# Altium schematic sheet HVPS.SchDoc
size 584 x 381 mm; SheetNumber: 1; SheetTotal: 1
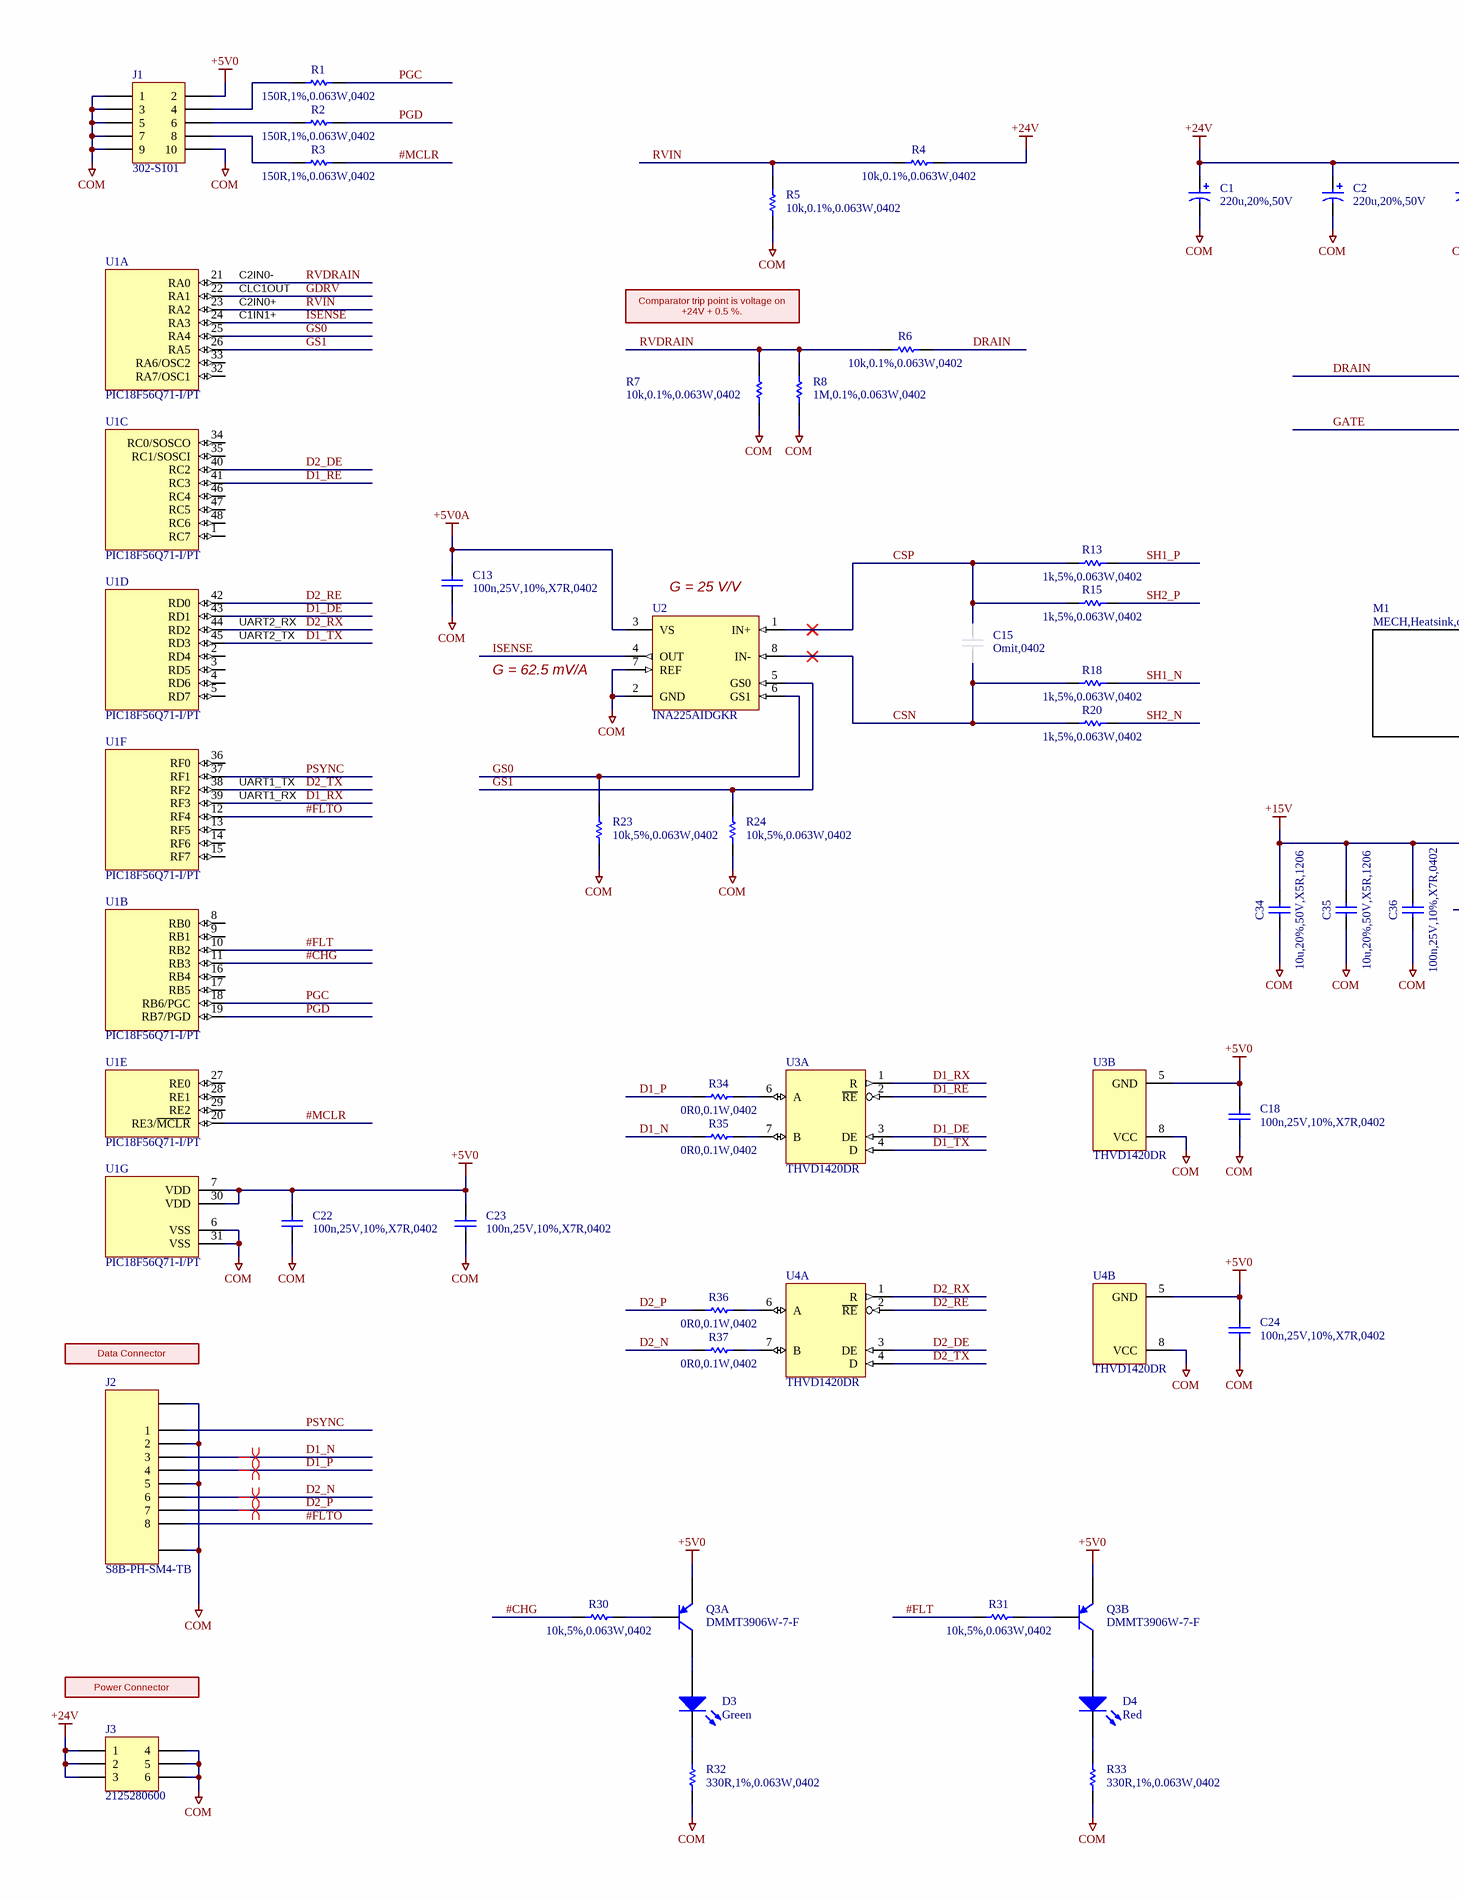
[diagram p0: HVPS.SchDoc, left]
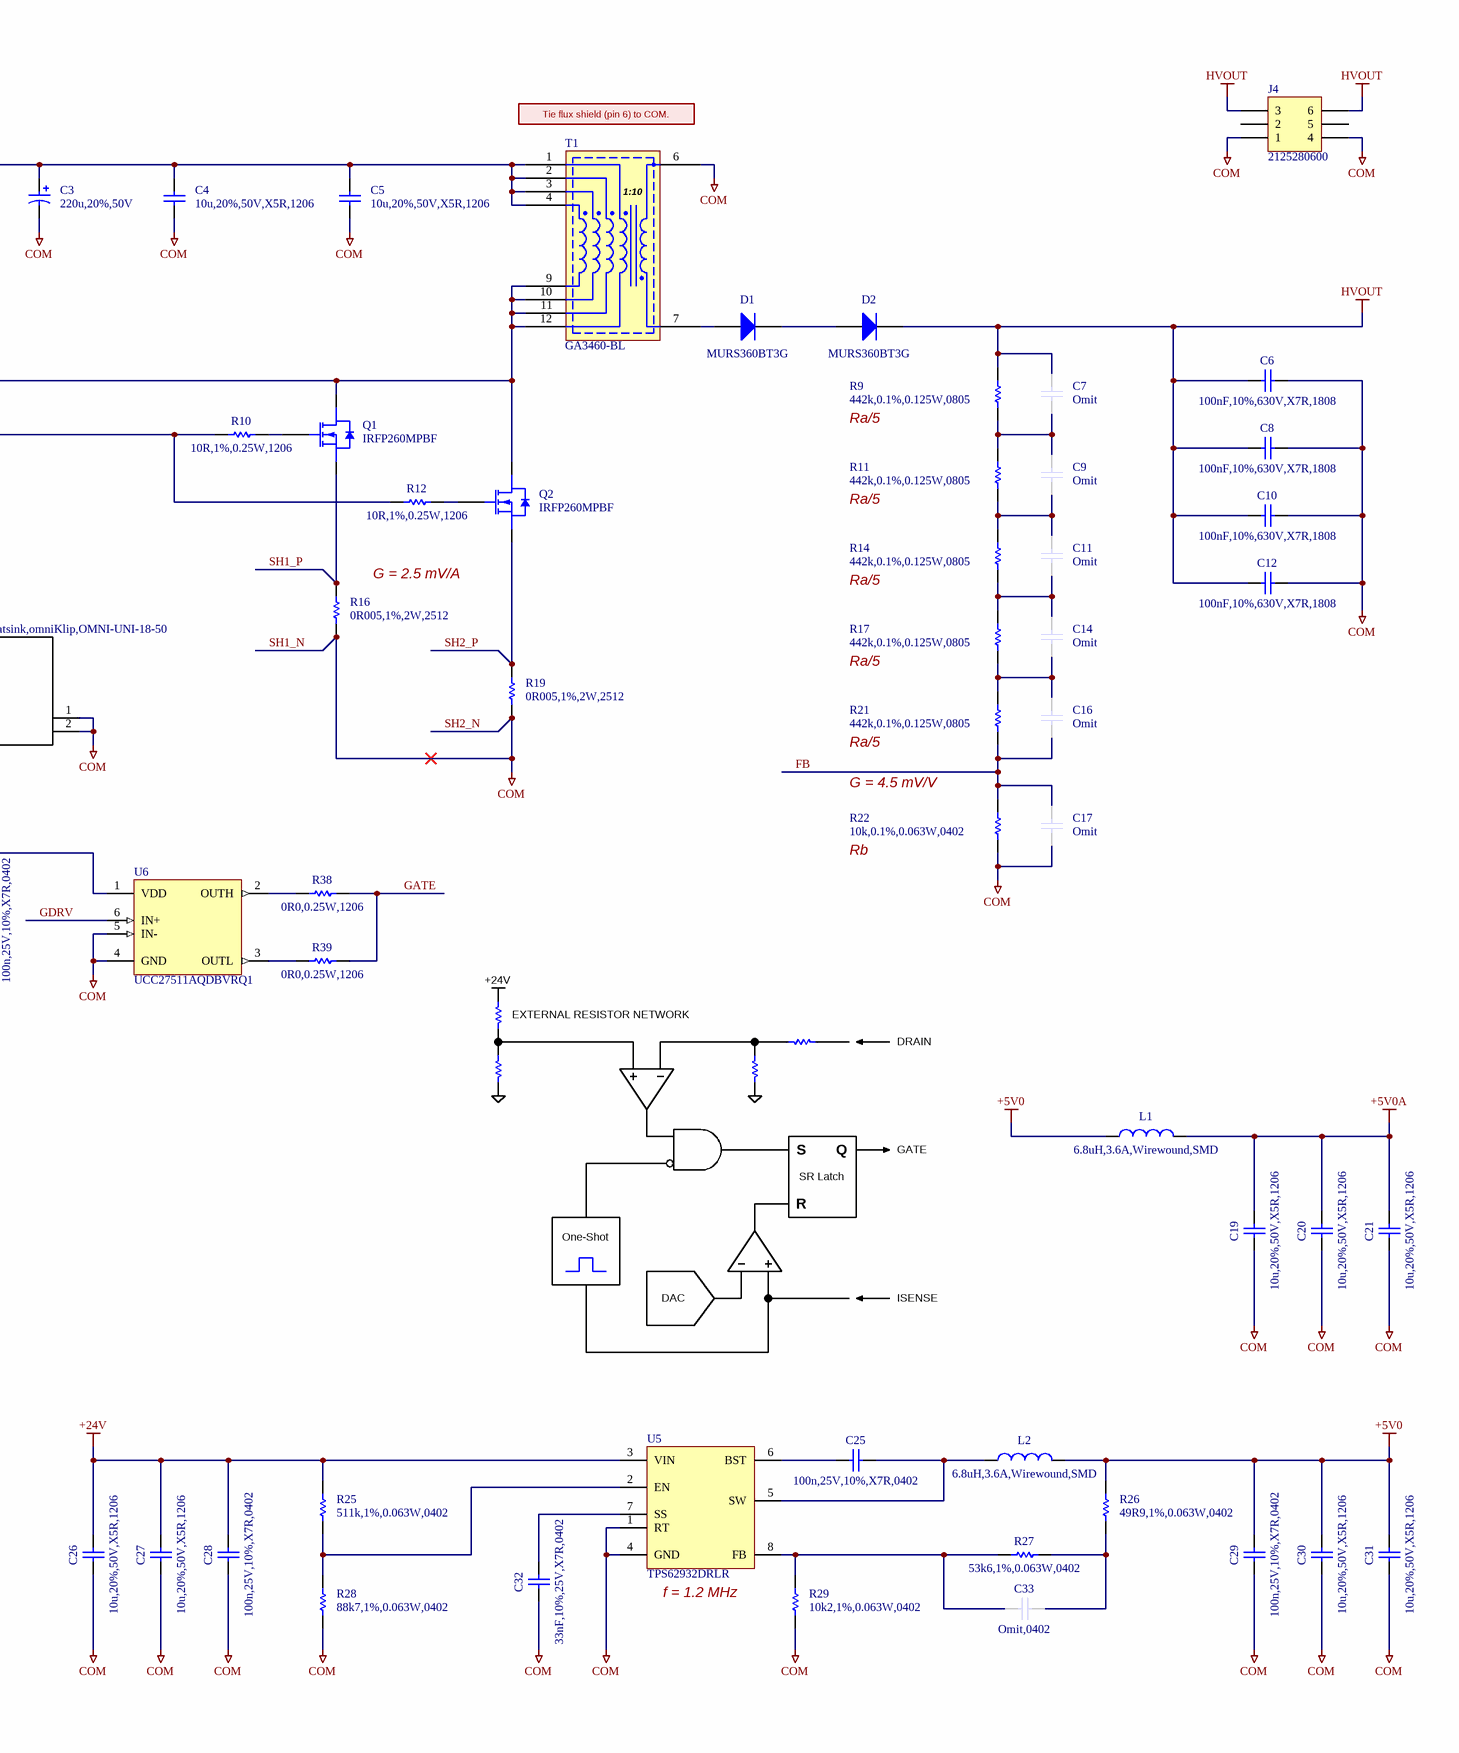
[diagram p1: HVPS.SchDoc, right]

## Parts
C1  220u,20%,50V  [CAPPR500W60D1000H1600B]
C2  220u,20%,50V  [CAPPR500W60D1000H1600B]
C3  220u,20%,50V  [CAPPR500W60D1000H1600B]
C4  10u,20%,50V,X5R,1206  [CAPC3216X16N]
C5  10u,20%,50V,X5R,1206  [CAPC3216X16N]
C6  100nF,10%,630V,X7R,1808  [KEMET_PKG_LC]
C7  Omit  [CAPC_0805]  (no BOM)
C8  100nF,10%,630V,X7R,1808  [KEMET_PKG_LC]
C9  Omit  [CAPC_0805]  (no BOM)
C10  100nF,10%,630V,X7R,1808  [KEMET_PKG_LC]
C11  Omit  [CAPC_0805]  (no BOM)
C12  100nF,10%,630V,X7R,1808  [KEMET_PKG_LC]
C13  100n,25V,10%,X7R,0402  [CAPC1005X06N]
C14  Omit  [CAPC_0805]  (no BOM)
C15  Omit,0402  [CAPC1005X06N]  (no BOM)
C16  Omit  [CAPC_0805]  (no BOM)
C17  Omit  [CAPC_0805]  (no BOM)
C18  100n,25V,10%,X7R,0402  [CAPC1005X06N]
C19  10u,20%,50V,X5R,1206  [CAPC3216X16N]
C20  10u,20%,50V,X5R,1206  [CAPC3216X16N]
C21  10u,20%,50V,X5R,1206  [CAPC3216X16N]
C22  100n,25V,10%,X7R,0402  [CAPC1005X06N]
C23  100n,25V,10%,X7R,0402  [CAPC1005X06N]
C24  100n,25V,10%,X7R,0402  [CAPC1005X06N]
C25  100n,25V,10%,X7R,0402  [CAPC1005X06N]
C26  10u,20%,50V,X5R,1206  [CAPC3216X16N]
C27  10u,20%,50V,X5R,1206  [CAPC3216X16N]
C28  100n,25V,10%,X7R,0402  [CAPC1005X06N]
C29  100n,25V,10%,X7R,0402  [CAPC1005X06N]
C30  10u,20%,50V,X5R,1206  [CAPC3216X16N]
C31  10u,20%,50V,X5R,1206  [CAPC3216X16N]
C32  33nF,10%,25V,X7R,0402  [CAPC1005X06N]
C33  Omit,0402  [CAPC1005X06N]  (no BOM)
C34  10u,20%,50V,X5R,1206  [CAPC3216X16N]
C35  10u,20%,50V,X5R,1206  [CAPC3216X16N]
C36  100n,25V,10%,X7R,0402  [CAPC1005X06N]
D1  MURS360BT3G  [ONSEMI_SMB]
D2  MURS360BT3G  [ONSEMI_SMB]
D3  Green  [LITE-ON_LTST-C190KGKT]
D4  Red  [LITE-ON_LTST-C190KRKT]
J1  302-S101  [ONSHORE_302-S101]
J2  S8B-PH-SM4-TB  [JST_S8B-PH-SM4-TB]
J3  2125280600  [MOLEX_2125280600]
J4  2125280600  [MOLEX_2125280600]
L1  6.8uH,3.6A,Wirewound,SMD  [BOURNS_SRN6045TA]
L2  6.8uH,3.6A,Wirewound,SMD  [BOURNS_SRN6045TA]
M1  MECH,Heatsink,omniKlip,OMNI-UNI-18-50  [WAKEFIELD_OMNI-UNI-18-50]
Q1  IRFP260MPBF  [INFINEON_PKG_TO247AD]
Q2  IRFP260MPBF  [INFINEON_PKG_TO247AD]
Q3  DMMT3906W-7-F  [DIODES_SOT363]  (parts A,B of 2)
R1  150R,1%,0.063W,0402  [RESC1005X04N]
R2  150R,1%,0.063W,0402  [RESC1005X04N]
R3  150R,1%,0.063W,0402  [RESC1005X04N]
R4  10k,0.1%,0.063W,0402  [RESC1005X04N]
R5  10k,0.1%,0.063W,0402  [RESC1005X04N]
R6  10k,0.1%,0.063W,0402  [RESC1005X04N]
R7  10k,0.1%,0.063W,0402  [RESC1005X04N]
R8  1M,0.1%,0.063W,0402  [RESC1005X04N]
R9  442k,0.1%,0.125W,0805  [RESC2012X07N]
R10  10R,1%,0.25W,1206  [RESC3216X06N]
R11  442k,0.1%,0.125W,0805  [RESC2012X07N]
R12  10R,1%,0.25W,1206  [RESC3216X06N]
R13  1k,5%,0.063W,0402  [RESC1005X04N]
R14  442k,0.1%,0.125W,0805  [RESC2012X07N]
R15  1k,5%,0.063W,0402  [RESC1005X04N]
R16  0R005,1%,2W,2512  [OHMITE_PKG_MCS3264]
R17  442k,0.1%,0.125W,0805  [RESC2012X07N]
R18  1k,5%,0.063W,0402  [RESC1005X04N]
R19  0R005,1%,2W,2512  [OHMITE_PKG_MCS3264]
R20  1k,5%,0.063W,0402  [RESC1005X04N]
R21  442k,0.1%,0.125W,0805  [RESC2012X07N]
R22  10k,0.1%,0.063W,0402  [RESC1005X04N]
R23  10k,5%,0.063W,0402  [RESC1005X04N]
R24  10k,5%,0.063W,0402  [RESC1005X04N]
R25  511k,1%,0.063W,0402  [RESC1005X04N]
R26  49R9,1%,0.063W,0402  [RESC1005X04N]
R27  53k6,1%,0.063W,0402  [RESC1005X04N]
R28  88k7,1%,0.063W,0402  [RESC1005X04N]
R29  10k2,1%,0.063W,0402  [RESC1005X04N]
R30  10k,5%,0.063W,0402  [RESC1005X04N]
R31  10k,5%,0.063W,0402  [RESC1005X04N]
R32  330R,1%,0.063W,0402  [RESC1005X04N]
R33  330R,1%,0.063W,0402  [RESC1005X04N]
R34  0R0,0.1W,0402  [RESC1005X04N]
R35  0R0,0.1W,0402  [RESC1005X04N]
R36  0R0,0.1W,0402  [RESC1005X04N]
R37  0R0,0.1W,0402  [RESC1005X04N]
R38  0R0,0.25W,1206  [RESC3216X06N]
R39  0R0,0.25W,1206  [RESC3216X06N]
T1  GA3460-BL  [COILCRAFT_GA3460-BL]
U1  PIC18F56Q71-I/PT  [TSQFP50P900X900X120-48N]  (parts A,B,C,D,E,F,G of 7)
U2  INA225AIDGKR  [SOP65P490X110-8]
U3  THVD1420DR  [TEXASINSTRUMENTS_PKG_D0008A]  (parts A,B of 2)
U4  THVD1420DR  [TEXASINSTRUMENTS_PKG_D0008A]  (parts A,B of 2)
U5  TPS62932DRLR  [TEXASINSTRUMENTS_PKG_DRL0008A]
U6  UCC27511AQDBVRQ1  [SOTFL95P260X145-6]

## Nets
+5V0: C18.2 C22.2 C23.2 C24.2 C29.2 C30.2 C31.2 J1.2 L1.1 L2.2 Q3.4(E1) Q3.5(E2) R26.2 U1.7(VDD) U1.30(VDD) U3.5(GND) U4.5(GND)
+5V0A: C13.2 C19.2 C20.2 C21.2 L1.2 U2.3(VS)
+15V: C34.2 C35.2 C36.2 U6.1(VDD)
+24V: C1.1 C2.1 C3.1 C4.2 C5.2 C26.2 C27.2 C28.2 J3.1 J3.2 J3.3 R4.1 R25.2 T1.1 T1.2 T1.3 T1.4 U5.3(VIN)
HVOUT: C6.2 C7.2 C8.2 C10.2 C12.2 D2.1(K) J4.3 J4.6 R9.2
SH1_N: C1.2 C2.2 C3.2 C4.1 C5.1 C6.1 C8.1 C10.1 C12.1 C13.1 C17.1 C18.1 C19.1 C20.1 C21.1 C22.1 C23.1 C24.1 C26.1 C27.1 C28.1 C29.1 C30.1 C31.1 C32.1 C34.1 C35.1 C36.1 J1.1 J1.3 J1.5 J1.7 J1.9 J1.10 J2.0 J2.2 J2.5 J3.4 J3.5 J3.6 J4.1 J4.4 M1.1 M1.2 R5.2 R7.2 R8.1 R16.1 R18.2 R19.1 R20.2 R22.1 R23.1 R24.1 R28.1 R29.1 R32.1 R33.1 T1.6 U1.6(VSS) U1.31(VSS) U2.2(GND) U2.7(REF) U3.8(VCC) U4.8(VCC) U5.1(RT) U5.4(GND) U6.4(GND) U6.5(IN-)  [also labelled COM, SH2_N]
#CHG: R30.2 U1.11(RB3)
#FLT: R31.2 U1.10(RB2)
#FLTO: J2.8 U1.12(RF4)
#MCLR: R3.2 U1.20(RE3/~{MCLR})
CSN: C15.1 R18.1 R20.1 U2.8(IN-)
CSP: C15.2 R13.1 R15.1 U2.1(IN+)
D1_DE: U1.43(RD1) U3.3(DE)
D1_N: J2.3 R35.1
D1_P: J2.4 R34.1
D1_RE: U1.41(RC3) U3.2(~{RE})
D1_RX: U1.39(RF3) U3.1(R)
D1_TX: U1.45(RD3) U3.4(D)
D2_DE: U1.40(RC2) U4.3(DE)
D2_N: J2.6 R37.1
D2_P: J2.7 R36.1
D2_RE: U1.42(RD0) U4.2(~{RE})
D2_RX: U1.44(RD2) U4.1(R)
D2_TX: U1.38(RF2) U4.4(D)
DRAIN: Q1.2(D) Q2.2(D) R6.1 T1.9 T1.10 T1.11 T1.12
FB: C16.1 C17.2 R21.1 R22.2
GATE: R10.1 R12.1 R38.2 R39.2
GDRV: U1.22(RA1) U6.6(IN+)
GS0: R23.2 U1.25(RA4) U2.6(GS1)
GS1: R24.2 U1.26(RA5) U2.5(GS0)
ISENSE: U1.24(RA3) U2.4(OUT)
PGC: R1.2 U1.18(RB6/PGC)
PGD: R2.2 U1.19(RB7/PGD)
PSYNC: J2.1 U1.37(RF1)
RVDRAIN: R6.2 R7.1 R8.2 U1.21(RA0)
RVIN: R4.2 R5.1 U1.23(RA2)
SH1_P: Q1.3(S) R13.2 R16.2
SH2_P: Q2.3(S) R15.2 R19.2
NetC7_1: C7.1 C9.2 R9.1 R11.2
NetC9_1: C9.1 C11.2 R11.1 R14.2
NetC11_1: C11.1 C14.2 R14.1 R17.2
NetC14_1: C14.1 C16.2 R17.1 R21.2
NetC25_1: C25.1 L2.1 U5.5(SW)
NetC25_2: C25.2 U5.6(BST)
NetC32_2: C32.2 U5.7(SS)
NetC33_1: C33.1 R27.2 R29.2 U5.8(FB)
NetC33_2: C33.2 R26.1 R27.1
NetD1_1: D1.1(K) D2.2(A)
NetD1_2: D1.2(A) T1.7
NetD3_A: D3.A Q3.3(C1)
NetD3_C: D3.C R32.2
NetD4_A: D4.A Q3.6(C2)
NetD4_C: D4.C R33.2
NetJ1_4: J1.4 R1.1
NetJ1_6: J1.6 R2.1
NetJ1_8: J1.8 R3.1
NetQ1_1: Q1.1(G) R10.2
NetQ2_1: Q2.1(G) R12.2
NetQ3_1: Q3.1(B2) R31.1
NetQ3_2: Q3.2(B1) R30.1
NetR25_1: R25.1 R28.2 U5.2(EN)
NetR34_2: R34.2 U3.6(A)
NetR35_2: R35.2 U3.7(B)
NetR36_2: R36.2 U4.6(A)
NetR37_2: R37.2 U4.7(B)
NetR38_1: R38.1 U6.2(OUTH)
NetR39_1: R39.1 U6.3(OUTL)

Not connected (* = marked no-connect by the designer): J4 2 5; U1 1(RC7) 2(RD4) 3(RD5) 4(RD6) 5(RD7) 8(RB0) 9(RB1) 13(RF5) 14(RF6) 15(RF7) 16(RB4) 17(RB5) 27(RE0) 28(RE1) 29(RE2) 32(RA7/OSC1) 33(RA6/OSC2) 34(RC0/SOSCO) 35(RC1/SOSCI) 36(RF0) 46(RC4) 47(RC5) 48(RC6)

## Layout directives
differential pair: D1_N, D1_P, D2_N, D2_P

## Notes on the sheet
- (near T1) Tie flux shield (pin 6) to COM.
- (near U1) C2IN0-
- (near U1) C2IN0+
- (near U1) CLC1OUT
- (near U1) C1IN1+
- Comparator trip point is voltage on +24V + 0.5 %.
- Ra/5
- G = 2.5 mV/A
- (near U1) UART2_TX
- (near U1) UART2_RX
- (near U2) G = 25 V/V
- G = 62.5 mV/A
- G = 4.5 mV/V
- (near U1) UART1_TX
- (near U1) UART1_RX
- Rb
- +24V
- EXTERNAL RESISTOR NETWORK
- DRAIN
- S
- SR Latch
- Q
- GATE
- One-Shot
- R
- DAC
- ISENSE
- (near J2) Data Connector
- (near U5) f = 1.2 MHz
- Power Connector
- (in symbol XFR,Flyback,COILCRAFT_GA3460-BL) 1:10

## Library data of the parts
C1-C3 = CAP,Alum,220uF,20%,50VDC,Radial,Thru: 220 ï¿½F 50 V Aluminum Electrolytic Capacitors Radial, Can 5000 Hrs @ 105ï¿½C; Manufacturer 1: Rubycon; Manufacturer 1 Part Number: 50YXG220MEFCT810X16; Vendor 1 Part Number: 1189-3771-1-ND; Vendor 1: Digikey; Part Name: CAP,Alum,220uF,20%,50VDC,Radial,Thru; CreatedBy: Judd Foster; HelpURL: https://www.rubycon.co.jp/wp-content/uploads/catalog-aluminum/YXG.pdf; Value: 220u
C4 C5 C19-C21 C26 C27 C30 C31 C34 C35 = CAP,Cer,10uF,50VDC,X5R,1206: 10ï¿½F ï¿½20% 50V Ceramic Capacitor X5R 1206 (3216 Metric); Manufacturer 1: Samsung Electro-Mechanics; Manufacturer 1 Part Number: CL31A106MBHNNNE; Vendor 1 Part Number: 1276-6736-1-ND; Vendor 1: Digikey; Part Name: CAP,Cer,10uF,50VDC,X5R,1206; CreatedBy: Judd Foster; HelpURL: https://www.samsungsem.com/resources/file/global/support/product_catalog/MLCC.pdf; Value: 10u
C6 C8 C10 C12 = CAP,Cer,100nF,10%,630V,X7R,1808: 0.1 ÂµF Â±10% 630V Ceramic Capacitor X7R 1808 (4520 Metric); Manufacturer 1: KEMET; Manufacturer 1 Part Number: C1808C104KBRAC7800; Vendor 1 Part Number: 399-C1808C104KBRAC7800CT-ND; Vendor 1: DigiKey; Part Name: CAP,Cer,100nF,10%,630V,X7R,1808; CreatedBy: Judd Foster; HelpURL: https://content.kemet.com/datasheets/KEM_C1010_X7R_HV_SMD.pdf; Value: 100nF
C7 C9 C11 C14 C16 C17 = CAP,Omit,0805: Part Name: CAP,Omit,0805; CreatedBy: Judd Foster; HelpURL: N/A; Manufacturer 1: N/A; Manufacturer 1 Part Number: N/A; Vendor 1: N/A; Vendor 1 Part Number: N/A; Value: Omit
C13 C18 C22-C25 C28 C29 C36 = CAP,Cer,100nF,10%,25VDC,X7R,0402: 0.1ï¿½F ï¿½10% 25V Ceramic Capacitor X7R 0402 (1005 Metric); Manufacturer 1: Murata Electronics; Manufacturer 1 Part Number: GRM155R71E104KE14J; Vendor 1 Part Number: 490-14603-1-ND; Vendor 1: DigiKey; Value: 100nF; Part Name: CAP,Cer,100nF,10%,25VDC,X7R,0402; CreatedBy: Judd Foster; HelpURL: https://search.murata.co.jp/Ceramy/image/img/A01X/G101/ENG/GRM155R71E104KE14-01.pdf
C15 C33 = CAP,Omit,0402: Omit; Part Name: CAP,Omit,0402; CreatedBy: Judd Foster; HelpURL: N/A; Manufacturer 1: N/A; Manufacturer 1 Part Number: N/A; Vendor 1: N/A; Vendor 1 Part Number: N/A; Value: Omit
C32 = CAP,Cer,33nF,10%,25V,X7R,0402: 0.033 ÂµF Â±10% 25V Ceramic Capacitor X7R 0402 (1005 Metric); Manufacturer 1: Murata Electronics; Manufacturer 1 Part Number: GRM155R71E333KA88D; Vendor 1 Part Number: 490-3253-1-ND; Vendor 1: DigiKey; Part Name: CAP,Cer,33nF,10%,25V,X7R,0402; CreatedBy: Judd Foster; HelpURL: https://search.murata.co.jp/Ceramy/image/img/A01X/G101/ENG/GRM155R71E333KA88-01.pdf; Value: 33nF
D1 D2 = Diode,Gen,600V,3A,SMB: Diode 600 V 3A Surface Mount SMB; Manufacturer 1: onsemi; Vendor 1 Part Number: MURS360BT3GOSCT-ND; Vendor 1: Digikey; Part Name: Diode,Gen,600V,3A,SMB; CreatedBy: Judd Foster; HelpURL: https://www.onsemi.com/pdf/datasheet/murs360bt3-d.pdf; Manufacturer 1 Part Number: MURS360BT3G
D3 = LED,Green,SMD,0603: Green 571nm LED Indication - Discrete 2V 0603 (1608 Metric); Manufacturer 1: Lite-On Inc.; Manufacturer 1 Part Number: LTST-C190KGKT; Vendor 1 Part Number: 160-1435-1-ND; Vendor 1: Digikey; Part Name: LED,Green,SMD,0603; CreatedBy: Judd Foster; HelpURL: https://optoelectronics.liteon.com/upload/download/DS22-2000-074/LTST-C190KGKT.PDF; Value: Green
D4 = LED,Red,SMD,0603: Red 631nm LED Indication - Discrete 2V 0603 (1608 Metric); Manufacturer 1: Lite-On Inc.; Manufacturer 1 Part Number: LTST-C190KRKT; Vendor 1 Part Number: 160-1436-1-ND; Vendor 1: Digikey; Part Name: LED,Red,SMD,0603; CreatedBy: Judd Foster; HelpURL: https://optoelectronics.liteon.com/upload/download/DS-22-99-0151/LTST-C190KRKT.pdf; Value: Red
J1 = Term,Header,5x2 Pin,2.54mm,Thru: Connector Header Through Hole 10 position 0.100" (2.54mm); Manufacturer 1: On Shore Technology Inc.; Vendor 1 Part Number: ED1543-ND; Vendor 1: Digikey; Part Name: Term,Header,5x2 Pin,2.54mm,Thru; CreatedBy: Judd Foster; HelpURL: https://mm.digikey.com/Volume0/opasdata/d220001/medias/docus/6025/302-S.pdf; Manufacturer 1 Part Number: 302-S101
J2 = CONN,JST,8 Pin,2mm,RA,SMD: Connector Header Surface Mount, Right Angle 8 position 0.079" (2.00mm); Manufacturer 1: JST Sales America Inc.; Vendor 1 Part Number: 455-S8B-PH-SM4-TBCT-ND; Vendor 1: DigiKey; Part Name: CONN,JST,8 Pin,2mm,RA,SMD; CreatedBy: Judd Foster; HelpURL: https://www.jst-mfg.com/product/pdf/eng/ePH.pdf; Manufacturer 1 Part Number: S8B-PH-SM4-TB
J3 J4 = Conn,Micro-Fit,Hdr,6Pos,RA,Thru: Connector Header Through Hole, Right Angle 6 position 0.118" (3.00mm); Manufacturer 1: Molex; Vendor 1 Part Number: 900-2125280600-ND; Vendor 1: Digikey; Part Name: Conn,Micro-Fit,Hdr,6Pos,RA,Thru; CreatedBy: Judd Foster; HelpURL: https://www.molex.com/webdocs/datasheets/pdf/en-us/2125280600_PCB_HEADERS.pdf; Manufacturer 1 Part Number: 2125280600
L1 L2 = IND,6.8uH,3.6A,Wirewound,SMD: 6.8 ÂµH Semi-Shielded Drum Core, Wirewound Inductor 3.6 A 34mOhm Nonstandard; Manufacturer 1: Bourns Inc.; Manufacturer 1 Part Number: SRN6045TA-6R8M; Vendor 1 Part Number: SRN6045TA-6R8MCT-ND; Vendor 1: DigiKey; Part Name: IND,6.8uH,3.6A,Wirewound,SMD; CreatedBy: Judd Foster; HelpURL: https://www.bourns.com/docs/Product-Datasheets/SRN6045TA.pdf; Value: 6.8uH
M1 = MECH,Heatsink,omniKlip,OMNI-UNI-18-50: Heat Sinks omniKlip Heat Sink for TO-247, TO-264, 18mm Wide, 50mm Long, Aluminum; Manufacturer 1: Wakefield Thermal; Vendor 1 Part Number: 567-OMNI-UNI-18-50; Vendor 1: Mouser; Part Name: MECH,Heatsink,omniKlip,OMNI-UNI-18-50; CreatedBy: Judd Foster; HelpURL: https://www.mouser.com/datasheet/2/433/omniKlip_Wakefield_Vette-3050203.pdf; Manufacturer 1 Part Number: OMNI-UNI-18-50
Q1 Q2 = MOSFET,N Ch,200V,50A,IRFP260MPBF: N-Channel 200 V 50A (Tc) 300W (Tc) Through Hole TO-247AC; Manufacturer 1: Infineon Technologies; Vendor 1 Part Number: IRFP260MPBF-ND; Vendor 1: DigiKey; Part Name: MOSFET,N Ch,200V,50A,IRFP260MPBF; CreatedBy: Judd Foster; HelpURL: https://www.infineon.com/dgdl/irfp260mpbf.pdf?fileId=5546d462533600a40153562894e91fe0; Manufacturer 1 Part Number: IRFP260MPBF
Q3 = Trans,PNP,Dual,40V,200mA,SOT363: Bipolar (BJT) Transistor Array 2 PNP (Dual) Matched Pair 40V 200mA 250MHz 200mW Surface Mount SOT-363; Manufacturer 1: Diodes Incorporated; Vendor 1 Part Number: DMMT3906W-FDICT-ND; Vendor 1: Digikey; Part Name: Trans,PNP,Dual,40V,200mA,SOT363; CreatedBy: Judd Foster; HelpURL: https://www.diodes.com/assets/Datasheets/ds30312.pdf; Manufacturer 1 Part Number: DMMT3906W-7-F
R1-R3 = RES,150R,1%,0.1W,0402: 150 Ohms ï¿½1% 0.063W, 1/16W Chip Resistor 0402 (1005 Metric) Automotive AEC-Q200, Moisture Resistant Thick Film; Manufacturer 1: TE Connectivity Passive Product; Manufacturer 1 Part Number: CRGCQ0402F150R; Vendor 1 Part Number: A129617CT-ND; Vendor 1: Digikey; Part Name: RES,150R,1%,0.1W,0402; CreatedBy: Judd Foster; HelpURL: https://www.te.com/commerce/DocumentDelivery/DDEController?Action=srchrtrv&DocNm=1773204-3&DocType=DS&DocLang=English; Value: 150R
R4-R7 R22 = RES,10k,0.1%,0.063W,0402: 10 kOhms ï¿½0.1% 0.1W, 1/10W Chip Resistor 0402 (1005 Metric) Automotive AEC-Q200 Thin Film; Manufacturer 1: Stackpole Electronics Inc; Manufacturer 1 Part Number: RNCF0402BTE10K0; Vendor 1 Part Number: RNCF0402BTE10K0CT-ND; Vendor 1: Digikey; Part Name: RES,10k,0.1%,0.063W,0402; CreatedBy: Judd Foster; HelpURL: https://www.seielect.com/catalog/sei-rncf.pdf; Value: 10k
R8 = RES,1M,0.1%,0.063W,0402: 1 MOhms Â±0.1% 0.063W, 1/16W Chip Resistor 0402 (1005 Metric) Thick Film; Manufacturer 1: YAGEO; Manufacturer 1 Part Number: RE0402BRE071ML; Vendor 1 Part Number: 13-RE0402BRE071MLCT-ND; Vendor 1: DigiKey; Part Name: RES,1M,0.1%,0.063W,0402; CreatedBy: Judd Foster; HelpURL: https://www.yageo.com/upload/media/product/app/datasheet/rchip/pyu-re_105_rohs_l.pdf; Value: 1M
R9 R11 R14 R17 R21 = RES,442k,0.1%,0.125W,0805: 442 kOhms Â±0.1% 0.125W, 1/8W Chip Resistor 0805 (2012 Metric) Automotive AEC-Q200 Thin Film; Manufacturer 1: Panasonic Electronic Components; Manufacturer 1 Part Number: ERA-6AEB4423V; Vendor 1 Part Number: P442KDACT-ND; Vendor 1: DigiKey; Part Name: RES,442k,0.1%,0.125W,0805; CreatedBy: Judd Foster; HelpURL: https://industrial.panasonic.com/cdbs/www-data/pdf/RDM0000/AOA0000C307.pdf; Value: 442k
R10 R12 = RES,10R,1%,0.25W,1206: 10 ï¿½1% 0.25W, 1/4W Chip Resistor 1206 (3216 Metric) Automotive AEC-Q200, Moisture Resistant Thick Film; Manufacturer 1: TE Connectivity Passive Product; Manufacturer 1 Part Number: CRGCQ1206F10R; Vendor 1 Part Number: A129786CT-ND; Vendor 1: Digikey; Part Name: RES,10R,1%,0.25W,1206; CreatedBy: Judd Foster; HelpURL: https://www.te.com/commerce/DocumentDelivery/DDEController?Action=srchrtrv&DocNm=1773204-3&DocType=DS&DocLang=English; Value: 10R
R13 R15 R18 R20 = RES,1k,5%,0.063W,0402: 1 kOhms ï¿½5% 0.063W, 1/16W Chip Resistor 0402 (1005 Metric) Automotive AEC-Q200 Thick Film; Manufacturer 1: Stackpole Electronics Inc; Manufacturer 1 Part Number: RMCF0402JT1K00; Vendor 1 Part Number: RMCF0402JT1K00CT-ND; Vendor 1: DIgikey; Part Name: RES,1k,5%,0.063W,0402; CreatedBy: Judd Foster; HelpURL: https://www.seielect.com/catalog/sei-rmcf_rmcp.pdf; Value: 1k
R16 R19 = RES,0R005,1%,2W,2512: 5 mOhms Â±1% 2W Chip Resistor 2512 (6432 Metric) Current Sense, Flame Retardant Coating, Safety Metal Element; Manufacturer 1: Ohmite; Manufacturer 1 Part Number: MCS3264R005FER; Vendor 1 Part Number: MCS3264R005FERCT-ND; Vendor 1: DigiKey; Value: 5m; Part Name: RES,0R005,1%,2W,2512; CreatedBy: Judd Foster; HelpURL: https://www.ohmite.com/assets/images/res-mcs.pdf
R23 R24 R30 R31 = RES,10k,5%,0.063W,0402: 10 kOhms ï¿½5% 0.063W, 1/16W Chip Resistor 0402 (1005 Metric) Automotive AEC-Q200 Thick Film; Manufacturer 1: Stackpole Electronics Inc; Manufacturer 1 Part Number: RMCF0402JT10K0; Vendor 1 Part Number: RMCF0402JT10K0CT-ND; Vendor 1: DIgikey; Part Name: RES,10k,5%,0.063W,0402; CreatedBy: Judd Foster; HelpURL: https://www.seielect.com/catalog/sei-rmcf_rmcp.pdf; Value: 10k
R25 = RES,511k,1%,0.063W,0402: 511 kOhms Â±1% 0.063W, 1/16W Chip Resistor 0402 (1005 Metric) Moisture Resistant Thick Film; Manufacturer 1: YAGEO; Manufacturer 1 Part Number: RC0402FR-07511KL; Vendor 1 Part Number: YAG3176CT-ND; Vendor 1: DigiKey; Part Name: RES,511k,1%,0.063W,0402; CreatedBy: Judd Foster; HelpURL: https://www.yageo.com/upload/media/product/products/datasheet/rchip/PYu-RC_Group_51_RoHS_L_12.pdf; Value: 511k
R26 = RES,49R9,1%,0.063W,0402: 49.9 Ohms Â±1% 0.063W, 1/16W Chip Resistor 0402 (1005 Metric) Moisture Resistant Thick Film; Manufacturer 1: YAGEO; Manufacturer 1 Part Number: RC0402FR-0749R9L; Vendor 1 Part Number: 311-49.9LRCT-ND; Vendor 1: DigiKey; Part Name: RES,49R9,1%,0.063W,0402; CreatedBy: Judd Foster; HelpURL: https://www.yageo.com/upload/media/product/products/datasheet/rchip/PYu-RC_Group_51_RoHS_L_12.pdf; Value: 49R9
R27 = RES.53k6,1%,0.063W,0402: 53.6 kOhms Â±1% 0.063W, 1/16W Chip Resistor 0402 (1005 Metric) Moisture Resistant Thick Film; Manufacturer 1: YAGEO; Manufacturer 1 Part Number: RC0402FR-0753K6L; Vendor 1 Part Number: 311-53.6KLRCT-ND; Vendor 1: DigiKey; Part Name: RES.53k6,1%,0.063W,0402; CreatedBy: Judd Foster; HelpURL: https://www.yageo.com/upload/media/product/products/datasheet/rchip/PYu-RC_Group_51_RoHS_L_12.pdf; Value: 53k6
R28 = RES,88k7,1%,0.063W,0402: 88.7 kOhms Â±1% 0.063W, 1/16W Chip Resistor 0402 (1005 Metric) Automotive AEC-Q200, Moisture Resistant Thick Film; Manufacturer 1: YAGEO; Manufacturer 1 Part Number: AC0402FR-0788K7L; Vendor 1 Part Number: 13-AC0402FR-0788K7LCT-ND; Vendor 1: DigiKey; Part Name: RES,88k7,1%,0.063W,0402; CreatedBy: Judd Foster; HelpURL: https://www.yageo.com/upload/media/product/productsearch/datasheet/rchip/PYu-AC_51_RoHS_L_10.pdf; Value: 88k7
R29 = RES,10k2,1%,0.063W,0402: 10.2 kOhms Â±1% 0.063W, 1/16W Chip Resistor 0402 (1005 Metric) Moisture Resistant Thick Film; Manufacturer 1: YAGEO; Manufacturer 1 Part Number: RC0402FR-0710K2L; Vendor 1 Part Number: YAG2950CT-ND; Vendor 1: DigiKey; Part Name: RES,10k2,1%,0.063W,0402; CreatedBy: Judd Foster; HelpURL: https://www.yageo.com/upload/media/product/products/datasheet/rchip/PYu-RC_Group_51_RoHS_L_12.pdf; Value: 10k2
R32 R33 = RES,330R,1%,0.063W,0402: 330 Ohms Â±1% 0.063W, 1/16W Chip Resistor 0402 (1005 Metric) Moisture Resistant Thick Film; Manufacturer 1: YAGEO; Manufacturer 1 Part Number: RC0402FR-07330RL; Vendor 1 Part Number: 311-330LRCT-ND; Vendor 1: DigiKey; Part Name: RES,330R,1%,0.063W,0402; CreatedBy: Judd Foster; HelpURL: https://www.yageo.com/upload/media/product/products/datasheet/rchip/PYu-RC_Group_51_RoHS_L_12.pdf; Value: 330R
R34-R37 = RES,0R0,0.1W,0402: 0 Ohms Jumper 0.1W, 1/10W Chip Resistor 0402 (1005 Metric) Automotive AEC-Q200 Thick Film; Manufacturer 1: Panasonic Electronic Components; Manufacturer 1 Part Number: ERJ-2GE0R00X; Vendor 1 Part Number: P0.0JCT-ND; Vendor 1: Digikey; Value: 0R; Part Name: RES,0R0,0.1W,0402; CreatedBy: Judd Foster; HelpURL: https://industrial.panasonic.com/cdbs/www-data/pdf/RDA0000/AOA0000C301.pdf
R38 R39 = RES,0R0,0.25W,1206: 0 Ohms Jumper Chip Resistor 1206 (3216 Metric) Automotive AEC-Q200 Thick Film; Manufacturer 1: Stackpole Electronics Inc; Manufacturer 1 Part Number: RMCF1206ZT0R00; Vendor 1 Part Number: RMCF1206ZT0R00CT-ND; Vendor 1: Digikey; Value: 0R; Part Name: RES,0R0,0.25W,1206; CreatedBy: Judd Foster; HelpURL: https://www.seielect.com/catalog/sei-rmcf_rmcp.pdf
T1 = XFR,Flyback,COILCRAFT_GA3460-BL: Audio Transformers / Signal Transformers GA3460 for LT3751 500V 50A; Vendor 1 Part Number: 994-GA3460-BL; Vendor 1: Mouser; Part Name: XFR,Flyback,COILCRAFT_GA3460-BL; CreatedBy: Judd Foster; HelpURL: https://www.mouser.ca/datasheet/2/597/ga3459-463457.pdf; Manufacturer 1: Coilcraft; Manufacturer 1 Part Number: GA3460-BL
U1 = PIC18F56Q71-I/PT: PIC PICï¿½ 18F Microcontroller IC 8-Bit 64MHz 64KB (64K x 8) FLASH 48-TQFP (7x7); Manufacturer 1: Microchip Technology; Vendor 1 Part Number: 150-PIC18F56Q71-I/PT-ND; Vendor 1: Digikey; Part Name: PIC18F56Q71-I/PT; CreatedBy: Judd Foster; HelpURL: https://ww1.microchip.com/downloads/aemDocuments/documents/MCU08/ProductDocuments/DataSheets/PIC18F26-46-56Q71-Microcontroller-Data-Sheet-DS40002329.pdf; Manufacturer 1 Part Number: PIC18F56Q71-I/PT
U2 = INA225AIDGKR: General Purpose Amplifier Circuit Rail-to-Rail 8-VSSOP; Manufacturer 1: Texas Instruments; Vendor 1 Part Number: 296-46096-1-ND; Vendor 1: Digikey; Part Name: INA225AIDGKR; CreatedBy: Judd Foster; HelpURL: https://www.ti.com/general/docs/suppproductinfo.tsp?distId=10&gotoUrl=https%3A%2F%2Fwww.ti.com%2Flit%2Fgpn%2Fina225; Manufacturer 1 Part Number: INA225AIDGKR
U3 U4 = THVD1420DR: 1/1 Transceiver Half RS422, RS485 8-SOIC; Manufacturer 1: Texas Instruments; Vendor 1 Part Number: 296-THVD1420DRCT-ND; Vendor 1: DigiKey; Part Name: THVD1420DR; CreatedBy: Judd Foster; HelpURL: https://www.ti.com/lit/ds/symlink/thvd1420.pdf?HQS=dis-dk-null-digikeymode-dsf-pf-null-wwe&ts=1735314435967; Manufacturer 1 Part Number: THVD1420DR
U5 = TPS62932DRLR: Buck Switching Regulator IC Positive Adjustable 0.8V 1 Output 2A SOT-583; Manufacturer 1: Texas Instruments; Vendor 1 Part Number: 296-TPS62932DRLRCT-ND; Vendor 1: DigiKey; Part Name: TPS62932DRLR; CreatedBy: Judd Foster; HelpURL: https://www.ti.com/lit/ds/symlink/tps62932.pdf?ts=1695814293505&ref_url=https%253A%252F%252Fwww.ti.com%252Fsitesearch%252Fen-us%252Fdocs%252Funiversalsearch.tsp%253FlangPref%253Den-US%2526searchTerm%253DTPS62932DRLR%2526nr%253D12%2526login-check%253Dtrue; Manufacturer 1 Part Number: TPS62932DRLR
U6 = UCC27511AQDBVRQ1: Gate Drivers Sngl-Ch high-Spd Low-Side Gate Driver; Manufacturer 1: Texas Instruments; Vendor 1 Part Number: 595-UCC27511AQDBVRQ1; Vendor 1: Mouser; Part Name: UCC27511AQDBVRQ1; CreatedBy: Judd Foster; HelpURL: https://www.ti.com/general/docs/suppproductinfo.tsp?distId=26&gotoUrl=https://www.ti.com/lit/gpn/ucc27511a-q1; Manufacturer 1 Part Number: UCC27511AQDBVRQ1